# Altium schematic sheet 05_USB.SchDoc
size A4
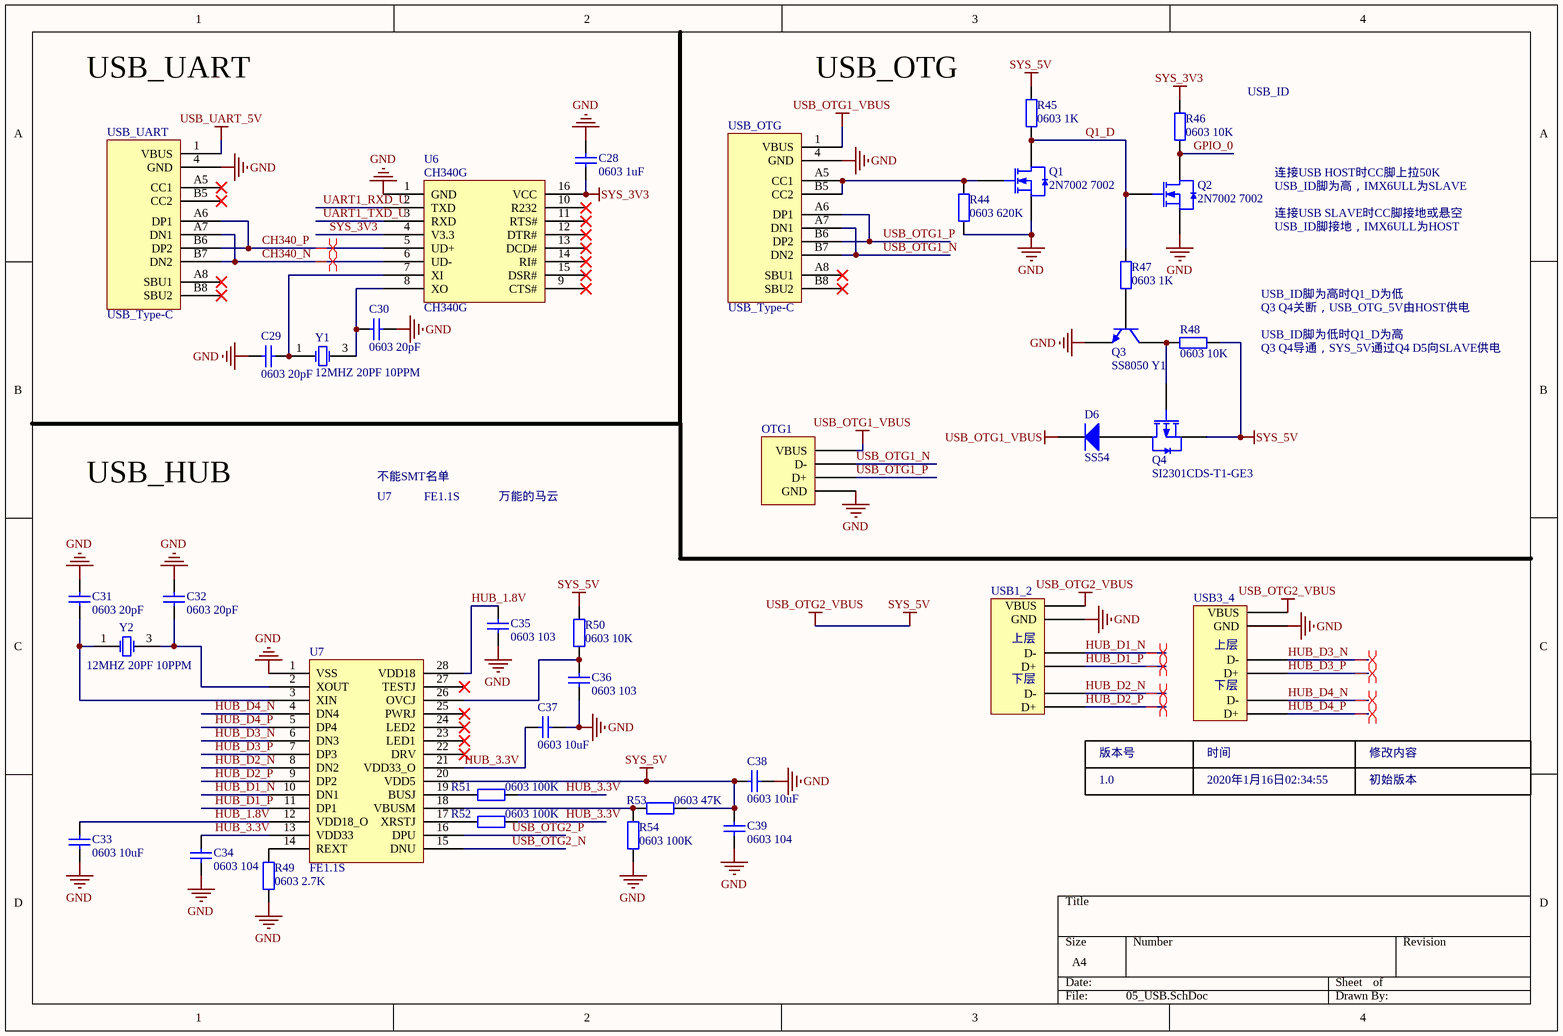
[diagram p0: 05_USB.SchDoc]

## Parts
C28  0603 1uF  [LC-0603_C]
C29  0603 20pF  [LC-0603_C]
C30  0603 20pF  [LC-0603_C]
C31  0603 20pF  [LC-0603_C]
C32  0603 20pF  [LC-0603_C]
C33  0603 10uF  [LC-0603_C]
C34  0603 104  [LC-0603_C]
C35  0603 103  [LC-0603_C]
C36  0603 103  [LC-0603_C]
C37  0603 10uF  [LC-0603_C]
C38  0603 10uF  [LC-0603_C]
C39  0603 104  [LC-0603_C]
D6  SS54  [LC-SMA(DO-214AC)_S1]
OTG1  (no value)  [USB插座_侧插]
Q1  2N7002 7002  [LC-SOT-23(SOT-23-3)]
Q2  2N7002 7002  [LC-SOT-23(SOT-23-3)]
Q3  SS8050 Y1  [LC-SOT-23(SOT-23-3)]
Q4  SI2301CDS-T1-GE3  [LC-SOT-23(SOT-23-3)]
R44  0603 620K  [LC-0603_R]
R45  0603 1K  [LC-0603_R]
R46  0603 10K  [LC-0603_R]
R47  0603 1K  [LC-0603_R]
R48  0603 10K  [LC-0603_R]
R49  0603 2.7K  [LC-0603_R]
R50  0603 10K  [LC-0603_R]
R51  0603 100K  [LC-0603_R]
R52  0603 100K  [LC-0603_R]
R53  0603 47K  [LC-0603_R]
R54  0603 100K  [LC-0603_R]
U6  CH340G  [LC-SOIC-16_150mil]
U7  FE1.1S  [LC-SSOP-28_150mil]
USB1_2  (no value)  [USB插座_双层]
USB3_4  (no value)  [USB插座_双层]
USB_OTG  USB_Type-C  [Type-C 16P]
USB_UART  USB_Type-C  [Type-C 16P]
Y1  12MHZ 20PF 10PPM  [LC-SMD-3225_4P]
Y2  12MHZ 20PF 10PPM  [LC-SMD-3225_4P]

## Nets
GND: C28.2 C29.2 C30.1 C31.1 C32.1 C33.2 C34.2 C35.2 C36.2 C37.2 C38.1 C39.2 OTG1.0(GND) Q1.2(S) Q2.2(S) Q3.2(E) R44.1 R49.1 R54.2 U6.1(GND) U7.1(VSS) USB1_2.0(GND) USB3_4.0(GND) USB_OTG.4(GND) USB_UART.4(GND)
SYS_3V3: C28.1 R46.2 U6.4(V3.3) U6.16(VCC)
SYS_5V: C38.2 C39.1 Q4.2(S) R45.2 R48.1 R50.2 R53.1 U7.20(VDD5) USB1_2.3(VBUS) USB3_4.3(VBUS)  [also labelled USB_OTG2_VBUS]
USB_OTG1_VBUS: D6.2(K) OTG1.3(VBUS) USB_OTG.1(VBUS)
USB_UART_5V: USB_UART.1(VBUS)
CH340_N: U6.6(UD-) USB_UART.A7(DN1) USB_UART.B7(DN2)
CH340_P: U6.5(UD+) USB_UART.A6(DP1) USB_UART.B6(DP2)
GPIO_0: Q2.3(D) R46.1
HUB_1.8V: C33.1 C35.1 U7.12(VDD18_O) U7.28(VDD18)
HUB_3.3V: C34.1 C37.1 R51.1 R52.1 U7.13(VDD33) U7.21(VDD33_O)
HUB_D1_N: U7.10(DN1) USB1_2.2(D-)
HUB_D1_P: U7.11(DP1) USB1_2.1(D+)
HUB_D2_N: U7.8(DN2) USB1_2.5(D-)
HUB_D2_P: U7.9(DP2) USB1_2.4(D+)
HUB_D3_N: U7.6(DN3) USB3_4.2(D-)
HUB_D3_P: U7.7(DP3) USB3_4.1(D+)
HUB_D4_N: U7.4(DN4) USB3_4.5(D-)
HUB_D4_P: U7.5(DP4) USB3_4.4(D+)
Q1_D: Q1.3(D) Q2.1(G) R45.1 R47.2
UART1_RXD_U: U6.2(TXD)
UART1_TXD_U: U6.3(RXD)
USB_OTG1_N: OTG1.2(D-) USB_OTG.A7(DN1) USB_OTG.B7(DN2)
USB_OTG1_P: OTG1.1(D+) USB_OTG.A6(DP1) USB_OTG.B6(DP2)
USB_OTG2_N: U7.15(DNU)
USB_OTG2_P: U7.16(DPU)
NetC29_1: C29.1 U6.7(XI) Y1.1(OSC1)
NetC30_2: C30.2 U6.8(XO) Y1.3(OSC2)
NetC31_2: C31.2 U7.3(XIN) Y2.1(OSC1)
NetC32_2: C32.2 U7.2(XOUT) Y2.3(OSC2)
NetC36_1: C36.1 R50.1 U7.26(OVCJ)
NetD6_1: D6.1(A) Q4.3(D)
NetQ1_1: Q1.1(G) R44.2 USB_OTG.A5(CC1) USB_OTG.B5(CC2)
NetQ3_1: Q3.1(B) R47.1
NetQ3_3: Q3.3(C) Q4.1(G) R48.2
NetR49_2: R49.2 U7.14(REXT)
NetR51_2: R51.2 U7.19(BUSJ)
NetR52_2: R52.2 U7.17(XRSTJ)
NetR53_2: R53.2 R54.1 U7.18(VBUSM)

Not connected (* = marked no-connect by the designer): U6 9(CTS#)* 10(R232)* 11(RTS#)* 12(DTR#)* 13(DCD#)* 14(RI#)* 15(DSR#)*; U7 22(DRV)* 23(LED1)* 24(LED2)* 25(PWRJ)* 27(TESTJ)*; USB_OTG A8(SBU1)* B8(SBU2)*; USB_UART A5(CC1)* A8(SBU1)* B5(CC2)* B8(SBU2)*

## Layout directives
differential pair: CH340_N, CH340_P, HUB_D1_N, HUB_D1_P, HUB_D2_N, HUB_D2_P, HUB_D3_N, HUB_D3_P, HUB_D4_N, HUB_D4_P

## Notes on the sheet
- USB_UART
- USB_OTG
- USB_ID
- 连接USB HOST时CC脚上拉50K
- USB_ID脚为高，IMX6ULL为SLAVE
- 连接USB SLAVE时CC脚接地或悬空
- USB_ID脚接地，IMX6ULL为HOST
- USB_ID脚为高时Q1_D为低
- Q3 Q4关断，USB_OTG_5V由HOST供电
- USB_ID脚为低时Q1_D为高
- Q3 Q4导通，SYS_5V通过Q4 D5向SLAVE供电
- USB_HUB
- U7
- 不能SMT名单
- FE1.1S
- 万能的马云
- 版本号
- 1.0
- 2020年1月16日02:34:55
- (near USB3_4) 时间
- 修改内容
- 初始版本
- (in symbol USB双层插座) 上层; 下层

## Library data of the parts
C28-C39 = 0603 1.5nF (152) 10% 50V: 贴片电容; ComponentLink1Description: 供应商链接; ComponentLink1URL: http://www.szlcsc.com/product/details_1947.html; Package: 0603; Supplier: LC; SuppliersPartNumber: C1595
D6 = SMA(DO-214AC) SS54: 二极管; ComponentLink1Description: 供应商链接; ComponentLink1URL: http://www.szlcsc.com/product/details_23178.html; Package: SMA(DO-214AC); Supplier: LC; SuppliersPartNumber: C22452
OTG1 = USB_插座
Q1 Q2 = 2N7002 7002: MOS(场效应管); ComponentLink1Description: 供应商链接; ComponentLink1URL: http://www.szlcsc.com/product/details_9040.html; Package: SOT-23(SOT-23-3); Supplier: LC; SuppliersPartNumber: C8545
Q3 = SOT-23 SS8050 Y1: 三极管; ComponentLink1Description: 供应商链接; ComponentLink1URL: http://www.szlcsc.com/product/details_2507.html; Package: SOT-23; Supplier: LC; SuppliersPartNumber: C2150
Q4 = SI2301CDS-T1-GE3: MOS(场效应管); ComponentLink1Description: 供应商链接; ComponentLink1URL: http://www.szlcsc.com/product/details_11030.html; Package: SOT-23(SOT-23-3); Supplier: LC; SuppliersPartNumber: C10487
R44-R54 = 0603 1.1KΩ (1101) 1%: 贴片电阻; ComponentLink1Description: 供应商链接; ComponentLink1URL: http://www.szlcsc.com/product/details_23491.html; Package: 0603; Supplier: LC; SuppliersPartNumber: C22764
U6 = CH340G: USB; ComponentLink1Description: 供应商链接; ComponentLink1URL: http://www.szlcsc.com/product/details_14927.html; Package: SOIC-16_150mil; Supplier: LC; SuppliersPartNumber: C14267
USB1_2 USB3_4 = USB双层插座
Y1 Y2 = SMD-3225_4P  12MHZ 20PF 10PPM: 贴片晶振; ComponentLink1Description: 供应商链接; ComponentLink1URL: http://www.szlcsc.com/product/details_9522.html; Package: SMD-3225_4P; Supplier: LC; SuppliersPartNumber: C9002